# Altium schematic sheet Sheet2.SchDoc
size A3; SheetNumber: 2
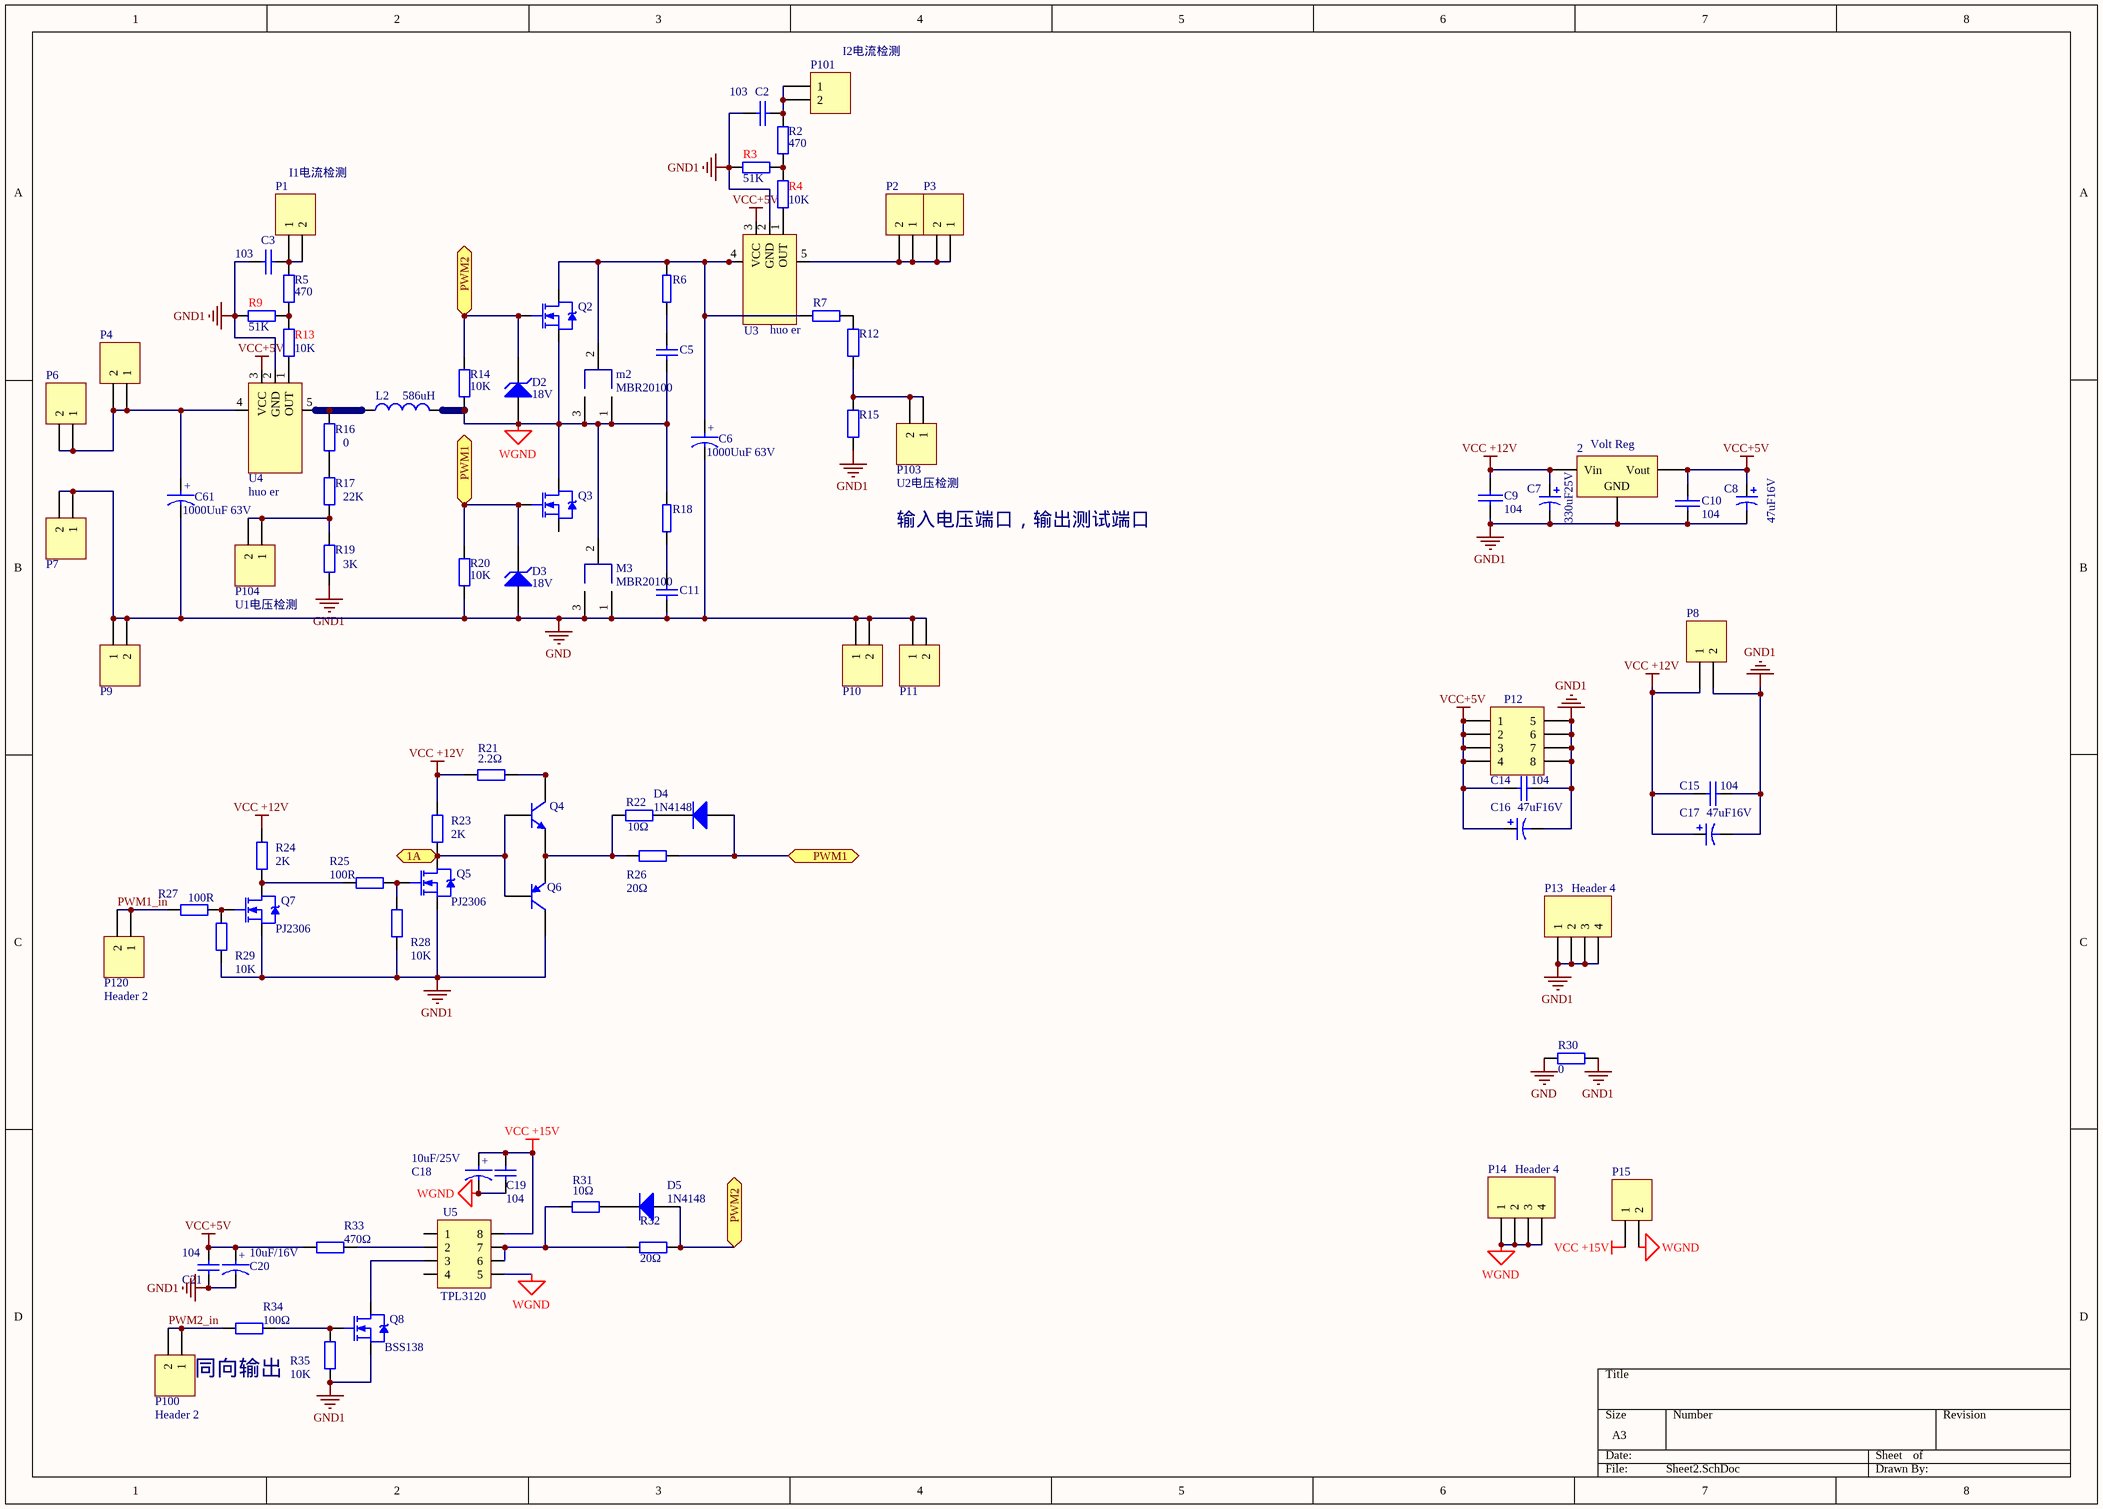
[diagram p0: Sheet2.SchDoc]

## Parts
2  Volt Reg  [7812]
C2  103  [C0805]
C3  103  [C0805]
C5  681  [接线端子]  (value not drawn)
C6  1000UuF 63V  [RB.4/.8]
C7  value 330uF25V  [RB.2/.4_1]
C8  value 47uF16V  [RB.1/.2]
C9  104  [C0805]
C10  104  [C0805]
C11  681  [接线端子]  (value not drawn)
C14  104  [C0805]
C15  104  [C0805]
C16  value 47uF16V  [RB.1/.2]
C17  value 47uF16V  [RB.1/.2]
C18  10uF/25V  [RB.1/.2]
C19  104  [C0805]
C20  10uF/16V  [RB.1/.2]
C21  104  [C0805]
C61  1000UuF 63V  [RB.4/.8]
D2  SubClass: 18V  [DIODE0.4_ZD]  (hidden comment: D Zener)
D3  SubClass: 18V  [DIODE0.4_ZD]  (hidden comment: D Zener)
D4  1N4148  [1206d]
D5  1N4148  [1206d]
L2  value 586uH  [130060]  (hidden comment: 12uH)
m2  MBR20100  [SFM-T3/A4.7V]
M3  MBR20100  [SFM-T3/A4.7V]
P1  I1电流检测  [HDR1X2]
P2  Header 2  [冷压插头]  (value not drawn)
P3  Header 2  [冷压插头]  (value not drawn)
P4  Header 2  [冷压插头]  (value not drawn)
P6  Header 2  [冷压插头]  (value not drawn)
P7  Header 2  [冷压插头]  (value not drawn)
P8  Header 2  [SIP2_B]  (value not drawn)
P9  Header 2  [冷压插头]  (value not drawn)
P10  Header 2  [冷压插头]  (value not drawn)
P11  Header 2  [冷压插头]  (value not drawn)
P12  (no value)  [HDR2X4_CEN]
P13  Header 4  [HDR1X4]
P14  Header 4  [HDR1X4]
P15  Header 2  [SIP2_B]  (value not drawn)
P100  Header 2  [HDR1X2]
P101  I2电流检测  [HDR1X2]
P103  U2电压检测  [HDR1X2]
P104  U1电压检测  [HDR1X2]
P120  Header 2  [HDR1X2]
Q2  IRF830  [SFM-T3/A4.7V]  (value not drawn)
Q3  IRF830  [SFM-T3/A4.7V]  (value not drawn)
Q4  8050  [TO-92]  (value not drawn)
Q5  PJ2306  [sot-23]
Q6  8550  [TO-92]  (value not drawn)
Q7  PJ2306  [sot-23]
Q8  BSS138  [sot-23]
R2  value 470  [R0805]  (hidden comment: Res2)
R3  51K  [R0805]
R4  10K  [R0805]
R5  value 470  [R0805]  (hidden comment: Res2)
R6  20Ω/2W  [S-R2W]  (value not drawn)
R7  Res2  [R0805]  (value not drawn)
R9  51K  [R0805]
R12  Res2  [R0805]  (value not drawn)
R13  10K  [R0805]
R14  value 10K  [R0805]  (hidden comment: Res2)
R15  Res2  [R0805]  (value not drawn)
R16  0  [R0805]
R17  22K  [R0805]
R18  20Ω/2W  [S-R2W]  (value not drawn)
R19  3K  [R0805]
R20  value 10K  [R0805]  (hidden comment: Res2)
R21  value 2.2Ω  [R0805]  (hidden comment: Res2)
R22  10Ω  [R0805]
R23  value 2K  [R0805]  (hidden comment: Res2)
R24  value 2K  [R0805]  (hidden comment: Res2)
R25  100R  [R0805]
R26  20Ω  [R0805]
R27  100R  [R0805]
R28  value 10K  [R0805]  (hidden comment: Res2)
R29  value 10K  [R0805]  (hidden comment: Res2)
R30  value 0  [R0805]  (hidden comment: Res2)
R31  value 10Ω  [R0805]  (hidden comment: Res2)
R32  20Ω  [R0805]
R33  470Ω  [R0805]
R34  100Ω  [R0805]
R35  value 10K  [R0805]  (hidden comment: Res2)
U3  huo er  [霍尔传感器-40A]
U4  huo er  [霍尔传感器-40A]
U5  TPL3120  [DIP-8]

## Ports
1A, PWM1, PWM2

## Nets
GND: C6.2 C11.2 C61.2 D3.1 M3.1 M3.3 P7.1 P7.2 P9.1 P9.2 P10.1 P10.2 P11.1 P11.2 R20.1 R30.1
GND1: 2.2(GND) C2.2 C3.2 C7.2 C8.2 C9.1 C10.1 C14.1 C15.1 C16.2 C17.2 C20.2 C21.2 P8.2 P12.5 P12.6 P12.7 P12.8 P13.1 P13.2 P13.3 P13.4 Q5.2 Q6.3(C) Q7.2 Q8.2 R3.1 R9.1 R15.1 R19.1 R28.1 R29.1 R30.2 R35.1 U3.2(GND) U4.2(GND)
VCC +12V: 2.1(Vin) C7.1 C9.2 C15.2 C17.1 P8.1 R21.1 R23.2 R24.2
VCC +15V: C18.1 C19.1 P15.1 U5.8
VCC+5V: 2.3(Vout) C8.1 C10.2 C14.2 C16.1 C20.1 C21.1 P12.1 P12.2 P12.3 P12.4 R33.1 U3.3(VCC) U4.3(VCC)
WGND: C5.2 C18.2 C19.2 D2.1 L2.2 m2.1 m2.3 M3.2 P14.1 P14.2 P14.3 P14.4 P15.2 Q2.3 Q3.2 R14.1 R18.1 U5.5
1A: Q4.1(B) Q5.3 Q6.2(B) R23.1 ; port 1A
PWM1: D3.2 D4.1 Q3.1 R20.2 R26.2 ; port PWM1
PWM1_in: P120.1 P120.2 R27.2
PWM2: D2.2 D5.1 Q2.1 R14.2 R32.2 ; port PWM2
PWM2_in: P100.1 P100.2 R34.1
NetC2_1: C2.1 P101.1 P101.2 R2.2
NetC3_1: C3.1 P1.1 P1.2 R5.2
NetC5_1: C5.1 R6.2
NetC6_1: C6.1 m2.2 Q2.2 R6.1 R7.2 U3.4
NetC11_1: C11.1 R18.2
NetC61_1: C61.1 P4.1 P4.2 P6.1 P6.2 U4.4
NetD4_2: D4.2 R22.2
NetD5_2: D5.2 R31.2
NetL2_1: L2.1 R16.2 U4.5
NetP2_1: P2.1 P2.2 P3.1 P3.2 U3.5
NetP103_1: P103.1 P103.2 R12.1 R15.2
NetP104_1: P104.1 P104.2 R17.1 R19.2
NetQ4_2: Q4.2(C) R21.2
NetQ4_3: Q4.3(E) Q6.1(E) R22.1 R26.1
NetQ5_1: Q5.1 R25.1 R28.2
NetQ7_1: Q7.1 R27.1 R29.2
NetQ7_3: Q7.3 R24.1 R25.2
NetQ8_1: Q8.1 R34.2 R35.2
NetQ8_3: Q8.3 U5.3
NetR2_1: R2.1 R3.2 R4.1
NetR4_2: R4.2 U3.1(OUT)
NetR5_1: R5.1 R9.2 R13.1
NetR7_1: R7.1 R12.2
NetR13_2: R13.2 U4.1(OUT)
NetR16_1: R16.1 R17.2
NetR31_1: R31.1 R32.1 U5.6 U5.7
NetR33_2: R33.2 U5.2

Not connected (* = marked no-connect by the designer): Q3 3; U5 1 4

## Notes on the sheet
- 输入电压端口，输出测试端口
- (near P100) 同向输出
- (in symbol CAPACITOR POL) +

## Library data of the parts
2 = Volt Reg: Voltage Regulator; Published: 24-Mar-1999; LatestRevisionDate: 29-May-2009; LatestRevisionNote: IPC-7351 Footprint Added.; PackageReference: D2PAK; Publisher: Altium Limited; PackageDescription: 3-Pin Transistor Outline Package 2.54 mm Pitch, 15.1 mm Lead Span
C2 C3 C9 C10 C14 C15 = CAP: Capacitor
C5 C11 = Cap: Capacitor; Manufacturer: Generic Components; Class: Passive; Published: 08/06/2000; Publisher: Altium Hobart Technology Centre; SubClass: Capacitor; Value: 681
C6 C18 C20 C61 = CAPACITOR POL: Capacitor
C7 C8 C16 C17 = Cap Pol1: Polarized Capacitor (Radial); Published: 8-Jun-2000; LatestRevisionDate: 17-Jul-2002; LatestRevisionNote: Re-released for DXP Platform.; PackageReference: RB7.6-15; Publisher: Altium Limited
C19 C21 = Cap: Capacitor; Manufacturer: Generic Components; Class: Passive; Value: 681; Published: 08/06/2000; Publisher: Altium Hobart Technology Centre; SubClass: Capacitor
D2 D3 = D Zener: Zener Diode; Manufacturer: Generic Components; Class: Discrete; Published: 08/06/2000; Publisher: Altium Hobart Technology Centre
D4 D5 = Diode: Default Diode; Manufacturer: Generic Components; Class: Discrete; SubClass: Diode - Switching; Published: 08/06/2000; Publisher: Altium Hobart Technology Centre
L2 = Inductor_2: Inductor; Code_IEC: 1005; Published: 8-Jun-2000; LatestRevisionDate: 29-May-2009; LatestRevisionNote: IPC-7351 Footprint Added.; PackageReference: 0402-A; Publisher: Altium Limited; PackageDescription: Chip Inductor; Code_JEITA: 0402
m2 M3 = 20010
P1-P4 P6-P11 P15 P100 P101 P103 P104 P120 = Header 2: Header, 2-Pin; LatestRevisionDate: 17-Jul-2002; LatestRevisionNote: Re-released for DXP Platform.; Publisher: Altium Limited
P12 = Header 4X2A: Header, 4-Pin, Dual row; LatestRevisionDate: 17-Jul-2002; LatestRevisionNote: Re-released for DXP Platform.; Publisher: Altium Limited
P13 P14 = Header 4: Header, 4-Pin; LatestRevisionDate: 17-Jul-2002; LatestRevisionNote: Re-released for DXP Platform.; Publisher: Altium Limited
Q2 Q3 Q5 Q7 Q8 = IRF840: CQ-IRF840
Q4 = 2N3904: NPN General Purpose Amplifier; pin to pad: 1>2 2>3 3>1; Manufacturer: Generic Components; Revised: 11-July-2000: SIM Model Added.; Class: Discrete; SubClass: BJT - Low Power; Published: 08/06/2000; Publisher: Altium Hobart Technology Centre
Q6 = PNP: PNP Bipolar Transistor; Manufacturer: Generic Components; Class: Discrete; SubClass: BJT - Low Power; Published: 08/06/2000; Publisher: Altium Hobart Technology Centre
R2 R5 R7 R12 R14-R17 R19-R21 R23-R25 R27-R29 R31 R35 = Res2: Resistor; Manufacturer: Generic Components; Class: Passive; Published: 08/06/2000; Publisher: Altium Hobart Technology Centre; SubClass: Resistor
R3 R4 R9 R13 = Res2: Resistor; Value: 4K7; Published: 8-Jun-2000; LatestRevisionDate: 17-Jul-2002; LatestRevisionNote: Re-released for DXP Platform.; PackageReference: AXIAL-0.4; Publisher: Altium Limited
R6 R18 = R
R22 = Res2: Resistor; Manufacturer: Generic Components; Class: Passive; Value: 51Ω; Published: 08/06/2000; Publisher: Altium Hobart Technology Centre; SubClass: Resistor
R26 R32-R34 = Res2: Resistor; Manufacturer: Generic Components; Class: Passive; Value: 47Ω; Published: 08/06/2000; Publisher: Altium Hobart Technology Centre; SubClass: Resistor
R30 = Res2: Resistor; Published: 8-Jun-2000; LatestRevisionDate: 17-Jul-2002; LatestRevisionNote: Re-released for DXP Platform.; PackageReference: AXIAL-0.4; Publisher: Altium Limited
U3 U4 = HOUER
U5 = LM386